# Altium schematic sheet Peripherals - USB.SchDoc
size 420 x 297 mm; SheetNumber: 5; SheetTotal: 8
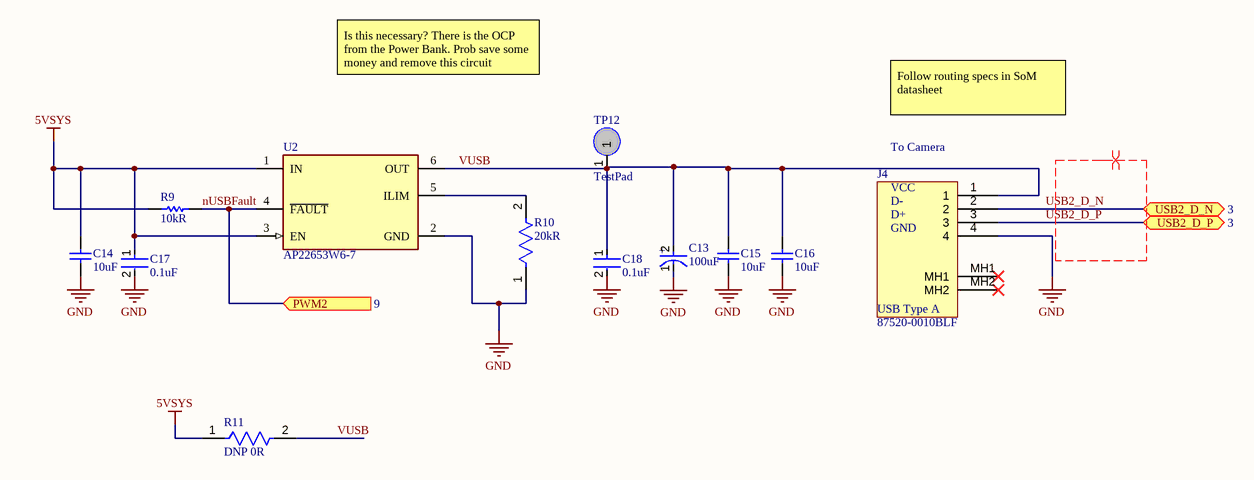
[diagram p0: Peripherals - USB.SchDoc]

## Parts
C13  100uF  [FP-UWX1E101MCL1GB-MFG]
C14  10uF  [CAPC2013X145X20ML20]
C15  10uF  [CAPC2013X145X20ML20]
C16  10uF  [CAPC2013X145X20ML20]
C17  0.1uF  [FP-C0603-CJ-MFG]
C18  0.1uF  [FP-C0603-CJ-MFG]
J4  87520-0010BLF  [875200010BLF]
R9  10kR  [RESC2013X60X35NL10T20]
R10  20kR  [FP-CRCW0805-e3-MFG]
R11  DNP 0R  [FP-RC1206-MFG]
TP12  TestPad  [TestPad50mil]
U2  AP22653W6-7  [FP-SOT26-MFG]

## Ports
PWM2 (in, see 9), USB2_D_N (bidir, see 3), USB2_D_P (bidir, see 3)

## Nets
5VSYS: C14.2 C17.1 R9.2 R11.1 U2.1(IN) U2.3(EN)
GND: C13.1(C) C14.1 C15.1 C16.1 C17.2 C18.2 J4.4 R10.1 U2.2(GND)
nUSBFault: R9.1 U2.4(~{FAULT}) ; port PWM2
USB2_D_N: J4.2 ; port USB2_D_N
USB2_D_P: J4.3 ; port USB2_D_P
VUSB: C13.2(A) C15.2 C16.2 C18.1 J4.1 R11.2 TP12.1 U2.6(OUT)
NetR10_2: R10.2 U2.5(ILIM)

Not connected (* = marked no-connect by the designer): J4 MH1* MH2*

## Layout directives
differential pair: (no net found under the mark)

## Notes on the sheet
- Is this necessary? There is the OCP from the Power Bank. Prob save some money and remove this circuit
- Follow routing specs in SoM datasheet
- (near J4) To Camera
- THIS DOCUMENT AND THE DATA DISCLOSED HEREIN OR
- HEREWITH IS THE PROPERTY OF ALTIUM LIMITED AND MAY
- DWG NO:
- REVISION
- REV:
- DESCRIPTION
- DATE
- APPROVED
- BE FREELY DISTRIBUTED IN WHOLE. NO RIGHTS ARE
- RESERVED OR EXPRESS OR IMPLIED WARANTEE GIVEN.
- ENG:
- APPROVALS
- PROJECT
- DSN:
- CHK:
- REFERENCE DOCUMENTS
- PROJECT REVISION:
- TITLE
- DOCUMENT REVISION:
- DESIGN ITEM:
- BOM:
- FAB DWG:
- PCB DWG:
- ASSY DWG:
- SCALE:
- A3
- SIZE
- CAGE CODE
- FILE NAME
- DWG NO.
- SHEET
- OF
- REV
- (in symbol 87520-0010BLF) VCC; D-; D+; GND; USB Type A
- (in symbol CMP-12462-000012-1) +

## Library data of the parts
C13 = CMP-12462-000012-1: UWX1E101MCL1GB / CAP ALUM 100UF 20% 25V SMD; Leakage Current: 3uA; Life (Hours): 2000Hour; Ripple Current: 110mA; Polarity: Polar; Dielectric Material: Aluminium; Dissipation Factor: 0.14%; Lead Diameter: 0.8mm; REACH SVHC: No SVHC; Mount: Surface Mount; Termination: SMD/SMT; Length: 5.4mm; Lead Free: Lead Free; Number of Pins: 2; Min Operating Temperature: -40°C; Diameter: 8mm; Package Quantity: 1000; Ripple Current (AC): 110mA; Case/Package: Radial; Width: 0.25inch; Voltage Rating (DC): 25V; Tolerance: 20%; Voltage: 25V; Capacitance: 100uF; Height - Seated (Max): 0.213inch; Packaging: Tape and Reel; Max Operating Temperature: 85°C; Height: 5.4mm; Weight: 0.01lb; Radiation Hardening: No; Lead Pitch: 2.3mm; Voltage Rating: 25V
C14-C16 = CMP-2000-05452-1: C2012X7R1A106K125AC Multilayer Ceramic Chip Capacitor, 10 uF, +/- 10%, 10 V, -55 to 125 degC, 0805 (2012 Metric), RoHS, Tape and Reel; Manufacturer: TDK; PCN Part Number: MLCCPartNumberChange30/Nov/2012; Capacitance: 10µF; Voltage - Rated: 10V; Product Training Modules: CSeriesGeneralApplicationsSEAT,CCV,andTVCLDesignToolsGuidetoReplacinganElectrolyticCapacitorwithanMLCC; Online Catalog: CSeries,GeneralPurpose; Other Names: 445-6857-6; Temperature Coefficient: X7R; Features: -; Ratings: -; Operating Temperature: -55degC~125degC; RoHS Information: RoHSCertificate-MLCC; Datasheet Version: Mar-15; Package / Case: 0805(2012Metric); Series: C; Mounting Type: SurfaceMount,MLCC; Family: CeramicCapacitors; Height - Seated (Max): -; Manufacturer URL: http://www.tdk.com/; Packaging: Digi-Reel; Tolerance: ±10%; Category: Capacitors; Applications: GeneralPurpose; Standard Package: 1; Size / Dimension: 0.079"Lx0.049"W(2.00mmx1.25mm); Datasheet URL: http://download.siliconexpert.com/pdfs/2015/4/21/15/54/45/779/tdk_/manual/37024850441143360mlcc_commercial_general_en.pdf; Lead Style: -; Lead Spacing: -; Thickness (Max): 0.057"(1.45mm); Package Reference: 805; Package Description: 2-Pin Surface Mount Device, Body 2 x 1.25 mm
C17 C18 = CMP-2006-03300-2: C0603X104K5RACTU CAP CER 0.1UF 50V X7R 0603; Manufacturer: Kemet; Capacitance: 100nF; Material: Ceramic; Tolerance: 10%; Value: 100nF; Temperature Coefficient: 15%; Temperature Range High: +125°C; Temperature Range Low: -55°C; Manufacturer Part Number: C0603X104K5RACTU; Voltage: 50V; ComponentLink2Description: Datasheet; RoHS: TRUE; ComponentLink2URL: https://content.kemet.com/datasheets/KEM_C1013_X7R_FT-CAP_SMD.pdf; Device Class L3: Ceramic Capacitors; Device Class L2: Capacitors; Package: C0603-CJ; Height: 0.95mm; Device Class L1: Passive Components; Temperature Characteristic: X7R; Lead Free: Yes; Digikey Description: CAP CER 0.1UF 50V X7R 0603; Automotive: No; Mouser Description: Capacitor; Ceramic; Cap 0.1uF; Tol+10%; SMT; Flexible Termination; Vol-Rtg 50V; TR; Temperature: -55°C to +125°C; Octopart: https://octopart.com/c0603x104k5ractu-kemet-9145062; Category: Cap; Voltage Rating: 50V; Ipc Land Pattern Name: CAPC16080X80
R9 = CMP-1659-00013-4: RC0805FR-0710KL Chip Resistor, 10 KOhm, +/- 1%, 0.125 W, -55 to 155 degC, 0805 (2012 Metric), RoHS, Tape and Reel; Manufacturer: Yageo; Voltage Rating: 150 V; Mount: Surface Mount; ComponentLink1Description: Manufacturer URL; ComponentLink2URL: http://www.yageo.com/documents/recent/PYu-RC_Group_51_RoHS_L_04.pdf; Pins: 2; Length: 2 mm; Min Operating Temperature: -55 degC; Height: 0.5 mm; Mounting Technology: Surface Mount; RoHSCompliant: true; REACH SVHC: No SVHC; ComponentLink1URL: http://www.yageo.com/; Max Operating Temperature: 155 degC; PackageReference: 0805; DatasheetVersion: Rev. 4, 02/2016; Package Quantity: 5000; Packaging: Tape and Reel; ComponentLink2Description: Datasheet; PackageDescription: 2-Pin Surface Mounted Device, Body 2 x 1.25 mm
R10 = CMP-2001-03667-2: RES Thick Film, 20kΩ, 1%, 0.125W, 100ppm/°C, 0805; Power Rating: 125mW; Voltage Rating (DC): 150V; Number of Pins: 2; Termination: SMD/SMT; Number of Terminations: 2; Case Code (Metric): 2012; Depth: 1.25mm; Packaging: Tape and Reel; Case Code (Imperial): 0805; Lead Free: Lead Free; Voltage Rating: 150V; Resistance: 20kR; Tolerance: 1%; Max Power Dissipation: 125mW; Composition: Thick Film; Height: 0.45mm; Weight: 0.000194oz; Working Voltage: 150V; Length: 2mm; Temperature Coefficient: 100ppm/°C; Mount: Surface Mount; Min Operating Temperature: -55°C; Features: Automotive AEC-Q200; Military Standard: Not; Contact Plating: Tin; Max Operating Temperature: 155°C; Case/Package: 0805; Package Quantity: 10; Width: 1.25mm
R11 = CMP-2100-03681-2: RC1206JR-070RL RES SMD 0 OHM JUMPER 1/4W 1206; Manufacturer: YAGEO; Voltage Rating: 200V; Temperature Coefficient: 300ppm/°C; Power Rating: 0.25W; Value: 0Ω; Tolerance: 5%; Manufacturer Part Number: RC1206JR-070RL; Temperature Range Low: -55°C; Category: Res; Automotive: No; Ipc Land Pattern Name: RESC310160X55; Device Class L1: Passive Components; Temperature: -55°C to +155°C; ComponentLink2URL: https://www.yageo.com/upload/media/product/productsearch/datasheet/rchip/PYu-RC_Group_51_RoHS_L_10.pdf; Lead Free: Yes; Height: 0.65mm; Footprint Url: https://www.yageo.com/upload/website/yageo_PYu-R_Mount_10_19050818_343.pdf; Package: RC1206; Digikey Description: RES SMD 0 OHM JUMPER 1/4W 1206; Temperature Range High: +155°C; Device Class L3: Chip SMD Resistors; Device Class L2: Resistors; Octopart: https://octopart.com/rc1206jr-070rl-yageo-40025601; Resistance: 0Ω; Series: RC; ComponentLink2Description: Datasheet; Composition: Thick Film; RoHS: TRUE; Mouser Description: Resistor: thick film; SMD; 1206; 0O; 0.25W; ±5%; -55÷155°C
U2 = CMP-12749-000002-1: LOAD SWITCH,SOT26,T&R,3K